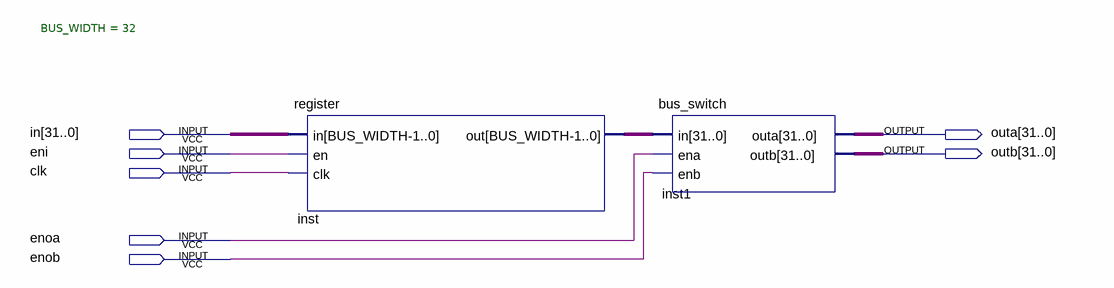
[diagram p0: schematic sheet]
// Quartus schematic cpu_register.bdf as structural Verilog: 2 symbols, 7 pins
module cpu_register (
  input  [31:0] in,
  input  eni,
  input  clk,
  input  enoa,
  input  enob,
  output [31:0] outa,
  output [31:0] outb
);

  wire [31:0] inst_out;

  register #(.BUS_WIDTH(32)) inst (.in(in), .en(eni), .clk(clk), .out(inst_out));
  bus_switch inst1 (.in(inst_out), .ena(enoa), .enb(enob), .outa(outa), .outb(outb));
endmodule
